# EAGLE schematic bike-alarm (EAGLE 7.2.0)
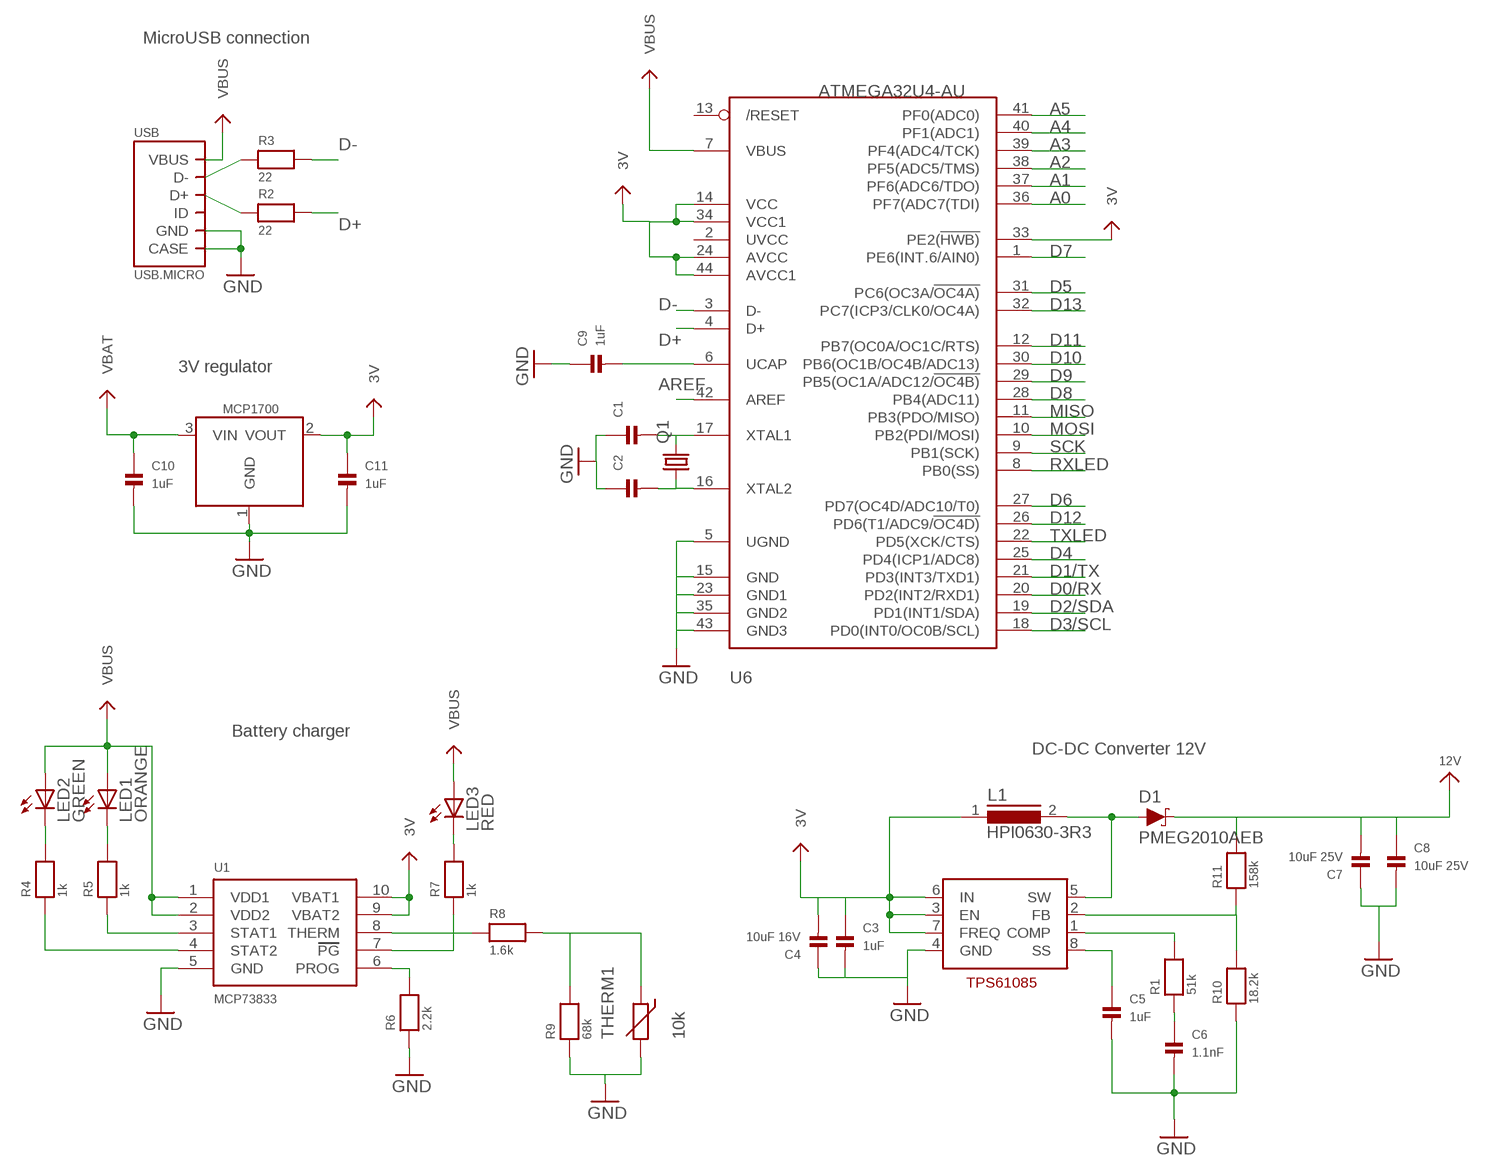
[diagram p0: schematic, sheet 1]

## Parts
C1  CAP_CERAMIC0603  [0603]
C2  CAP_CERAMIC0603  [0603]
C3  1uF  CAP_CERAMIC0603  [0603]
C4  10uF 16V  CAP_CERAMIC0805  [0805]
C5  1uF  CAP_CERAMIC0603  [0603]
C6  1.1nF  CAP_CERAMIC0603  [0603]
C7  10uF 25V  CAP_CERAMIC0805  [0805]
C8  10uF 25V  CAP_CERAMIC0805  [0805]
C9  1uF  CAP_CERAMIC0603  [0603]
C10  1uF  CAP_CERAMIC0603  [0603]
C11  1uF  CAP_CERAMIC0603  [0603]
D1  PMEG2010AEB  [SOD-523]
L1  HPI0630-3R3  HPI0630  [HPI0630]
LED1  ORANGE  LED3MM  [LED3MM]
LED2  GREEN  LED3MM  [LED3MM]
LED3  RED  LED3MM  [LED3MM]
Q1  8.00M-SMDHC  CRYSTALHC49UP  [HC49UP]
R1  51k  RESISTOR_0603  [_0603]
R2  22  RESISTOR_0603  [_0603]
R3  22  RESISTOR_0603  [_0603]
R4  1k  RESISTOR_0603  [_0603]
R5  1k  RESISTOR_0603  [_0603]
R6  2.2k  RESISTOR_0603  [_0603]
R7  1k  RESISTOR_0603  [_0603]
R8  1.6k  RESISTOR_0603  [_0603]
R9  68k  RESISTOR_0603  [_0603]
R10  18.2k  RESISTOR_0603  [_0603]
R11  158k  RESISTOR_0603  [_0603]
THERM1  10k  THERMISTOR-2,5  [RS-2,5]
U1  MCP73833  [MSOP10]
U6  ATMEGA32U4-AU  [TQFP44]
U$1  MCP1700  [SOT23-3]
U$4  TPS61085  [MSOP8]
USB  USB.MICRO  [1554266-1]

## Nets
3V: C11.1 U$1.2(VOUT)
12V: C7.2 C8.1 D1.C R11.2
A0: U6.36(PF7(ADC7(TDI))
A1: U6.37(PF6(ADC6/TDO))
A2: U6.38(PF5(ADC5/TMS))
A3: U6.39(PF4(ADC4/TCK))
A4: U6.40(PF1(ADC1))
A5: U6.41(PF0(ADC0))
AREF: U6.42(AREF)
D0/RX: U6.20(PD2(INT2/RXD1))
D1/TX: U6.21(PD3(INT3/TXD1))
D2/SDA: U6.19(PD1(INT1/SDA))
D3/SCL: U6.18(PD0(INT0/OC0B/SCL))
D4: U6.25(PD4(ICP1/ADC8))
D5: U6.31(PC6(OC3A/!OC4A))
D6: U6.27(PD7(OC4D/ADC10/T0))
D7: U6.1(PE6(INT.6/AIN0))
D8: U6.28(PB4(ADC11))
D9: U6.29(PB5(OC1A/ADC12/!OC4B))
D10: U6.30(PB6(OC1B/OC4B/ADC13))
D11: U6.12(PB7(OC0A/OC1C/RTS))
D12: U6.26(PD6(T1/ADC9/!OC4D))
D13: U6.32(PC7(ICP3/CLK0/OC4A))
D+: R2.2
D-: R3.2
GND: C1.1 C2.1 C3.2 C4.1 C5.2 C6.2 C7.1 C8.2 C9.1 C10.2 C11.2 R6.1 R9.1 R10.1 THERM1.2 U1.5(GND) U6.5(UGND) U6.15(GND) U6.23(GND1) U6.35(GND2) U6.43(GND3) U$1.1(GND) U$4.4(GND) USB.5(GND) USB.PAD1@1(CASE) USB.PAD1@2(CASE) USB.PAD1@VIA1(CASE) USB.PAD1@VIA2(CASE) USB.PAD1@VIA3(CASE) USB.PAD1@VIA4(CASE) USB.PAD1@VIA5(CASE) USB.PAD2(CASE) USB.PAD2@VIA1(CASE) USB.PAD2@VIA2(CASE) USB.PAD2@VIA3(CASE) USB.PAD2@VIA4(CASE) USB.PAD2@VIA5(CASE) USB.PAD2@VIA6(CASE) USB.PAD2@VIA7(CASE) USB.PAD3(CASE) USB.PAD3@VIA1(CASE) USB.PAD3@VIA2(CASE) USB.PAD3@VIA3(CASE) USB.PAD3@VIA4(CASE) USB.PAD3@VIA5(CASE) USB.PAD3@VIA6(CASE) USB.PAD3@VIA7(CASE) USB.PAD4@1(CASE) USB.PAD4@2(CASE) USB.PAD4@VIA1(CASE) USB.PAD4@VIA2(CASE) USB.PAD4@VIA3(CASE) USB.PAD4@VIA4(CASE) USB.PAD4@VIA5(CASE)
MISO: U6.11(PB3(PDO/MISO))
MOSI: U6.10(PB2(PDI/MOSI))
N$1: R3.1 USB.2(D-)
N$2: R2.1 USB.3(D+)
N$3: C5.1 U$4.8(SS)
N$4: R1.2 U$4.1(COMP)
N$5: R7.1 U1.7(PG)
N$6: LED2.K(C) R4.2
N$7: LED1.K(C) R5.2
N$8: R5.1 U1.3(STAT1)
N$9: R4.1 U1.4(STAT2)
N$10: LED3.K(C) R7.2
N$11: C2.2 Q1.1
N$12: R6.2 U1.6(PROG)
N$13: C1.2 Q1.2
N$14: R8.1 U1.8(THERM)
N$15: R8.2 R9.2 THERM1.1
N$16: R10.2 R11.1 U$4.2(FB)
N$17: C6.1 R1.1
N$18: D1.A L1.2 U$4.5(SW)
N$19: C9.2 U6.6(UCAP)
RXLED: U6.8(PB0(SS))
SCK: U6.9(PB1(SCK))
TXLED: U6.22(PD5(XCK/CTS))
VBAT: C3.1 C4.2 C10.1 L1.1 U1.9(VBAT2) U1.10(VBAT1) U6.14(VCC) U6.24(AVCC) U6.33(PE2(!HWB)) U6.34(VCC1) U6.44(AVCC1) U$1.3(VIN) U$4.3(EN) U$4.6(IN) U$4.7(FREQ) ; supply symbol labelled 3V
VBUS: LED1.A LED2.A LED3.A U1.1(VDD1) U1.2(VDD2) U6.7(VBUS) USB.1(VBUS)
Unconnected: U6.2(UVCC) U6.3(D-) U6.4(D+) U6.13(/RESET) U6.16(XTAL2) U6.17(XTAL1) USB.4(ID)

## Notes on the sheet
- MicroUSB connection
- 3V regulator
- Battery charger
- DC-DC Converter 12V

## Library data of the parts
C1-C11 = microbuilder:CAP_CERAMIC: Ceramic Capacitors 0402 - 0402 Surface Mount Capacitors 16pF 50V 5% [Digikey: 445-4899-2-ND] 18pF 50V 5% [Digikey: 490-1281-2-ND] 22pF 50V 5% [Digikey: 490-1283-2-ND] 68pF 50V 5% [Digikey: 490-1289-2-ND] 0.1uF 10V 10% [Digikey: 490-1318-2-ND] 1.0uF 6.3V 10% [Digikey: 490-1320-2-ND] 0603 - 0603 Surface Mount Capacitors 16 pF 50V 5% [Digikey: 445-5051-2-ND] 22 pF 50V [Digikey: PCC220ACVTR-ND] 33 pF 50V 5% [Digikey: 490-1415-1-ND] 56pF 50V 5% [Digikey: 490-1421-1-ND] 220pF 50V 5% [Digikey: 445-1285-1-ND] 680 pF 50V 2200 pF 50V 5% C0G [Digikey: 445-1297-1-ND] 5600 pF 100V 5% X7R [Digikey: 478-3711-1-ND] 0.1 µF 25V 10% [Digikey: PCC2277TR-ND] 0.22 µF 16V 10% X7R [Digikey: 445-1318-1-ND] 1.0 µF 25V 10% [Digikey: 445-5146-2-ND] 0603 - RF Specific 3pF 250V +/-0.1pF RF [Digikey: 712-1347-1-ND] 18 pF 250V 5% [Digikey: 478-3505-1-ND or 712-1322-1-ND] 56 pF 250V 5% C0G RF [Digikey: 490-4867-1-ND] 68 pF 250V RF [Digikey: 490-4868-1-ND] 0805 - 0805 Surface Mount Capacitors 220 pF 250V 2% RF Ceramic Capacitor [Digikey: 712-1398-1-ND] 1000 pF 50V 2% NP0 Ceramic Capacitor [Digikey: 478-3760-1-ND] 0.1 µF 25V 10% Ceramic Capacitor [Digikey: PCC1828TR-ND] 1.0 µF 16V 10% Ceramic Capacitor[Digikey: 490-1691-2-ND] 10.0 µF 10V 10% Ceramic Capacitor[Digikey: 709-1228-1-ND] 10.0 uF 16V 10% Ceramic Capacitor [Digikey: 478-5165-2-ND] 47 uF 6.3V 20% Ceramic Capacitor [Digikey: 587-1779-1-ND or 399-5506-1-ND] 1206 - 1206 Surface Mount Capacitors 47uF 10V 20% Ceramic Capacitor [Digikey: 490-5528-1-ND or 399-5508-1-ND or 445-6010-1-ND] 100uF 6.3V -20%, +80% Y5V Ceramic Capacitor (Digikey: 490-4512-1-ND, Mouser: 81-GRM31CF50J107ZE1L)
D1 = my:PMEG2010AEB
L1 = my:HPI0630: High Power Density, High Efficiency, Shielded Inductors Source: coiltronics_dr_series.pdf
LED1-LED3 = adafruit:LED: LED OSRAM: - CHIPLED LG R971, LG N971, LY N971, LG Q971, LY Q971, LO R971, LY R971 LH N974, LH R974 LS Q976, LO Q976, LY Q976 LO Q996 - Hyper CHIPLED LW Q18S LB Q993, LB Q99A, LB R99A - SideLED LS A670, LO A670, LY A670, LG A670, LP A670 LB A673, LV A673, LT A673, LW A673 LH A674 LY A675 LS A676, LA A676, LO A676, LY A676, LW A676 LS A679, LY A679, LG A679 - Hyper Micro SIDELED® LS Y876, LA Y876, LO Y876, LY Y876 LT Y87S - SmartLED LW L88C, LW L88S LB L89C, LB L89S, LG L890 LS L89K, LO L89K, LY L89K LS L896, LA L896, LO L896, LY L896 - TOPLED LS T670, LO T670, LY T670, LG T670, LP T670 LSG T670, LSP T670, LSY T670, LOP T670, LYG T670 LG T671, LOG T671, LSG T671 LB T673, LV T673, LT T673, LW T673 LH T674 LS T676, LA T676, LO T676, LY T676, LB T676, LH T676, LSB T676, LW T676 LB T67C, LV T67C, LT T67C, LS T67K, LO T67K, LY T67K, LW E67C LS E67B, LA E67B, LO E67B, LY E67B, LB E67C, LV E67C, LT E67C LW T67C LS T679, LY T679, LG T679 LS T770, LO T770, LY T770, LG T770, LP T770 LB T773, LV T773, LT T773, LW T773 LH T774 LS E675, LA E675, LY E675, LS T675 LS T776, LA T776, LO T776, LY T776, LB T776 LHGB T686 LT T68C, LB T68C - Hyper Mini TOPLED® LB M676 - Mini TOPLED Santana® LG M470 LS M47K, LO M47K, LY M47K Source: http://www.osram.convergy.de/
Q1 = adafruit:CRYSTAL: CRYSTAL; OC_FARNELL: unknown; OC_NEWARK: unknown
R1-R11 = microbuilder:RESISTOR: Resistors 0402 - 0402 Surface Mount Package 22 Ohm 1% 1/16W [Digikey: 311-22.0LRTR-ND] 33 Ohm 5% 1/16W 1.0K 5% 1/16W 1.5K 5% 1/16W 2.0K 1% 1/16W 10.0K 1% 1/16W [Digikey: 311-10.0KLRTR-ND] 10.0K 5% 1/16W [Digikey: RMCF0402JT10K0TR-ND] 12.1K 1% 1/16W [Digikey: 311-22.0LRTR-ND] 100.0K 5% 1/16W 0603 - 0603 Surface Mount Package 0 Ohm 1/10 Watt 1% Resistor 15 Ohm 1/10 Watt 1% Resistor 33 Ohm 1/10 Watt 1% Resistor 49.9 Ohm 1/10 Watt 1% Resistor 100 Ohm 1/10 Watt 1% Resistor 150 Ohm 1/10 Watt 1% Resistor 240 Ohm 1/10 Watt 1% Resistor 390 Ohm 1/10 Watt 1% Resistor 560 Ohm 1/10 Watt 1% Resistor 680 Ohm 1/10 Watt 1% Resistor 750 Ohm 1/10 Watt 1% Resistor 1.0K Ohm 1/10 Watt 1% Resistor 1.5K Ohm 1/10 Watt 1% Resistor 2.0K Ohm 1/10 Watt 1% Resistor 2.2K Ohm 1/10 Watt 1% Resistor 3.3K Ohm 1/10 Watt 1% Resistor 4.7K Ohm 1/10 Watt 1% Resistor 10.0K Ohm 1/10 Watt 1% Resistor 12.0K Ohm 1/10 Watt 1% Resistor 12.1K Ohm 1/10 Watt 1% Resistor 20.0K Ohm 1/10 Watt 1% Resistor 33.0K Ohm 1/10 Watt 1% Resistor 100.0K Ohm 1/10 Watt 1% Resistor 0805 - 0805 Surface Mount Package 0 Ohm 1/8 Watt 1% Resistor 33 Ohm 1/8 Watt 1% Resistor 100 Ohm 1/8 Watt 1% Resistor 150 Ohm 1/8 Watt 1% Resistor 200 Ohm 1/8 Watt 1% Resistor 240 Ohm 1/8 Watt 1% Resistor 330 Ohm 1/8 Watt 1% Resistor 390 Ohm 1/8 Watt 1% Resistor 470 Ohm 1/8 Watt 1% Resistor 1.0K Ohm 1/8 Watt 1% Resistor 1.5K Ohm 1/8 Watt 1% Resistor 2.0K Ohm 1/8 Watt 1% Resistor 4.7K Ohm 1/8 Watt 1% Resistor 5.1K Ohm 1/8 Watt 1% Resistor 5.6K Ohm 1/8 Watt 1% Resistor 10.0K Ohm 1/8 Watt 1% Resistor 22.0K Ohm 1/8 Watt 1% Resistor 33.0K Ohm 1/8 Watt 1% Resistor 100K Ohm 1/8 Watt 1% Resistor 1206 - 1206 Surface Mount Package 2012 - 2010 Surface Mount Package 0.11 Ohm 1/2 Watt 1% Resistor - Digikey: RHM.11UCT-ND
THERM1 = varistor:THERMISTOR: THERMISTOR
U1 = microbuilder:MCP73833: Lithium-Polymer/Lithium-Ion Battery Charger [Part No.] Microchip MCP73833 MSOP10 (tube only): Digikey: MCP73833T-AMI/UN or MCP73833-FCI/UN-ND Mouser: 579-MCP73833-AMI/UN DFN10 (tape): Digikey: Note Chips ending in 'AMI' have no timer, and chips ending in 'FCI' have a 6-hour timer that will end the charge sequence after 6 horus regqrdless of current charge level.
U6 = adafruit:ATMEGA32U4: http://www.ladyada.net/library/eagle
U$1 = my:MCP1700
U$4 = my:TPS61085
USB = te-connectivity:USB.MICRO